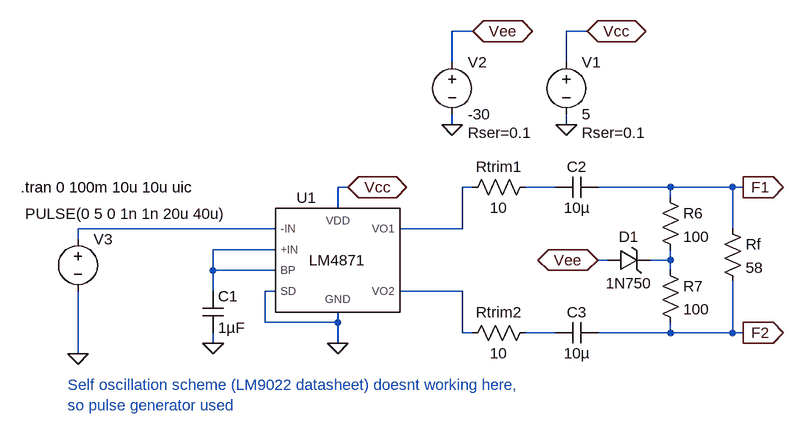
[diagram p0: schematic lm4871-filament.asc]
lm4871-filament.asc, the LTspice schematic file:
Version 4
SHEET 1 1548 852
WIRE 528 64 496 64
WIRE 704 64 672 64
WIRE 496 112 496 64
WIRE 672 112 672 64
WIRE 496 208 496 192
WIRE 672 208 672 192
WIRE 336 304 320 304
WIRE 528 304 512 304
WIRE 656 304 608 304
WIRE 832 304 720 304
WIRE 928 304 832 304
WIRE 944 304 928 304
WIRE 832 320 832 304
WIRE 320 336 320 304
WIRE 224 368 -80 368
WIRE 512 368 512 304
WIRE 512 368 416 368
WIRE 928 368 928 304
WIRE -80 384 -80 368
WIRE 224 400 128 400
WIRE 736 416 720 416
WIRE 832 416 832 400
WIRE 832 416 800 416
WIRE 128 432 128 400
WIRE 224 432 128 432
WIRE 832 432 832 416
WIRE 128 464 128 432
WIRE 224 464 208 464
WIRE 512 464 416 464
WIRE 208 512 208 464
WIRE 320 512 320 496
WIRE 320 512 208 512
WIRE 512 528 512 464
WIRE 528 528 512 528
WIRE 656 528 608 528
WIRE 832 528 832 512
WIRE 832 528 720 528
WIRE 928 528 928 448
WIRE 928 528 832 528
WIRE 944 528 928 528
WIRE 128 544 128 528
WIRE 320 544 320 512
WIRE -80 560 -80 464
FLAG 672 208 0
FLAG 704 64 Vcc
IOPIN 704 64 BiDir
FLAG 496 208 0
FLAG 528 64 Vee
IOPIN 528 64 BiDir
FLAG 720 416 Vee
IOPIN 720 416 BiDir
FLAG 944 304 F1
IOPIN 944 304 Out
FLAG 944 528 F2
IOPIN 944 528 Out
FLAG 320 544 0
FLAG 336 304 Vcc
IOPIN 336 304 BiDir
FLAG 128 544 0
FLAG -80 560 0
SYMBOL voltage 672 96 R0
WINDOW 123 0 0 Left 2
WINDOW 39 24 124 Left 2
SYMATTR SpiceLine Rser=0.1
SYMATTR InstName V1
SYMATTR Value 5
SYMBOL res 912 352 R0
SYMATTR InstName Rf
SYMATTR Value 58
SYMBOL cap 720 288 R90
WINDOW 0 0 32 VBottom 2
WINDOW 3 32 32 VTop 2
SYMATTR InstName C2
SYMATTR Value 10µ
SYMBOL cap 720 512 R90
WINDOW 0 0 32 VBottom 2
WINDOW 3 32 32 VTop 2
SYMATTR InstName C3
SYMATTR Value 10µ
SYMBOL voltage 496 96 R0
WINDOW 123 0 0 Left 2
WINDOW 39 24 124 Left 2
SYMATTR SpiceLine Rser=0.1
SYMATTR InstName V2
SYMATTR Value -30
SYMBOL zener 736 432 R270
WINDOW 0 36 32 VTop 2
WINDOW 3 -4 32 VBottom 2
SYMATTR InstName D1
SYMATTR Value 1N750
SYMBOL res 816 304 R0
SYMATTR InstName R6
SYMATTR Value 100
SYMBOL res 816 416 R0
SYMATTR InstName R7
SYMATTR Value 100
SYMBOL cap 112 464 R0
SYMATTR InstName C1
SYMATTR Value 1µF
SYMBOL LM4871 320 416 R0
SYMATTR InstName U1
SYMBOL voltage -80 368 R0
WINDOW 3 -81 -23 Left 2
WINDOW 123 0 0 Left 0
WINDOW 39 0 0 Left 0
SYMATTR InstName V3
SYMATTR Value PULSE(0 5 0 1n 1n 20u 40u)
SYMBOL res 624 288 R90
WINDOW 0 0 56 VBottom 2
WINDOW 3 32 56 VTop 2
SYMATTR InstName Rtrim1
SYMATTR Value 10
SYMBOL res 624 512 R90
WINDOW 0 0 56 VBottom 2
WINDOW 3 32 56 VTop 2
SYMATTR InstName Rtrim2
SYMATTR Value 10
TEXT -168 304 Left 2 !.tran 0 100m 10u 10u uic
TEXT -96 608 Left 2 ;Self oscillation scheme (LM9022 datasheet) doesnt working here,\nso pulse generator used

The netlist it stands for:
* lm4871-filament.asc
V1 Vcc 0 5 Rser=0.1
Rf F1 F2 58
C2 F1 N002 10µ
C3 F2 N007 10µ
V2 Vee 0 -30 Rser=0.1
D1 Vee N005 1N750
R6 F1 N005 100
R7 N005 F2 100
C1 N004 0 1µF
XU1 N004 N003 Vcc 0 0 N004 N001 N006 LM4871  ; pins +IN -IN VDD GND SD BP VO1 VO2
V3 N003 0 PULSE(0 5 0 1n 1n 20u 40u)
Rtrim1 N002 N001 10
Rtrim2 N007 N006 10
.model D D
.lib standard.dio
.tran 0 100m 10u 10u uic
* Self oscillation scheme (LM9022 datasheet) doesnt working here,
* so pulse generator used
.lib LM4871.LIB
.backanno
.end